# EAGLE schematic xr_vco_pots (EAGLE 7.3.0)
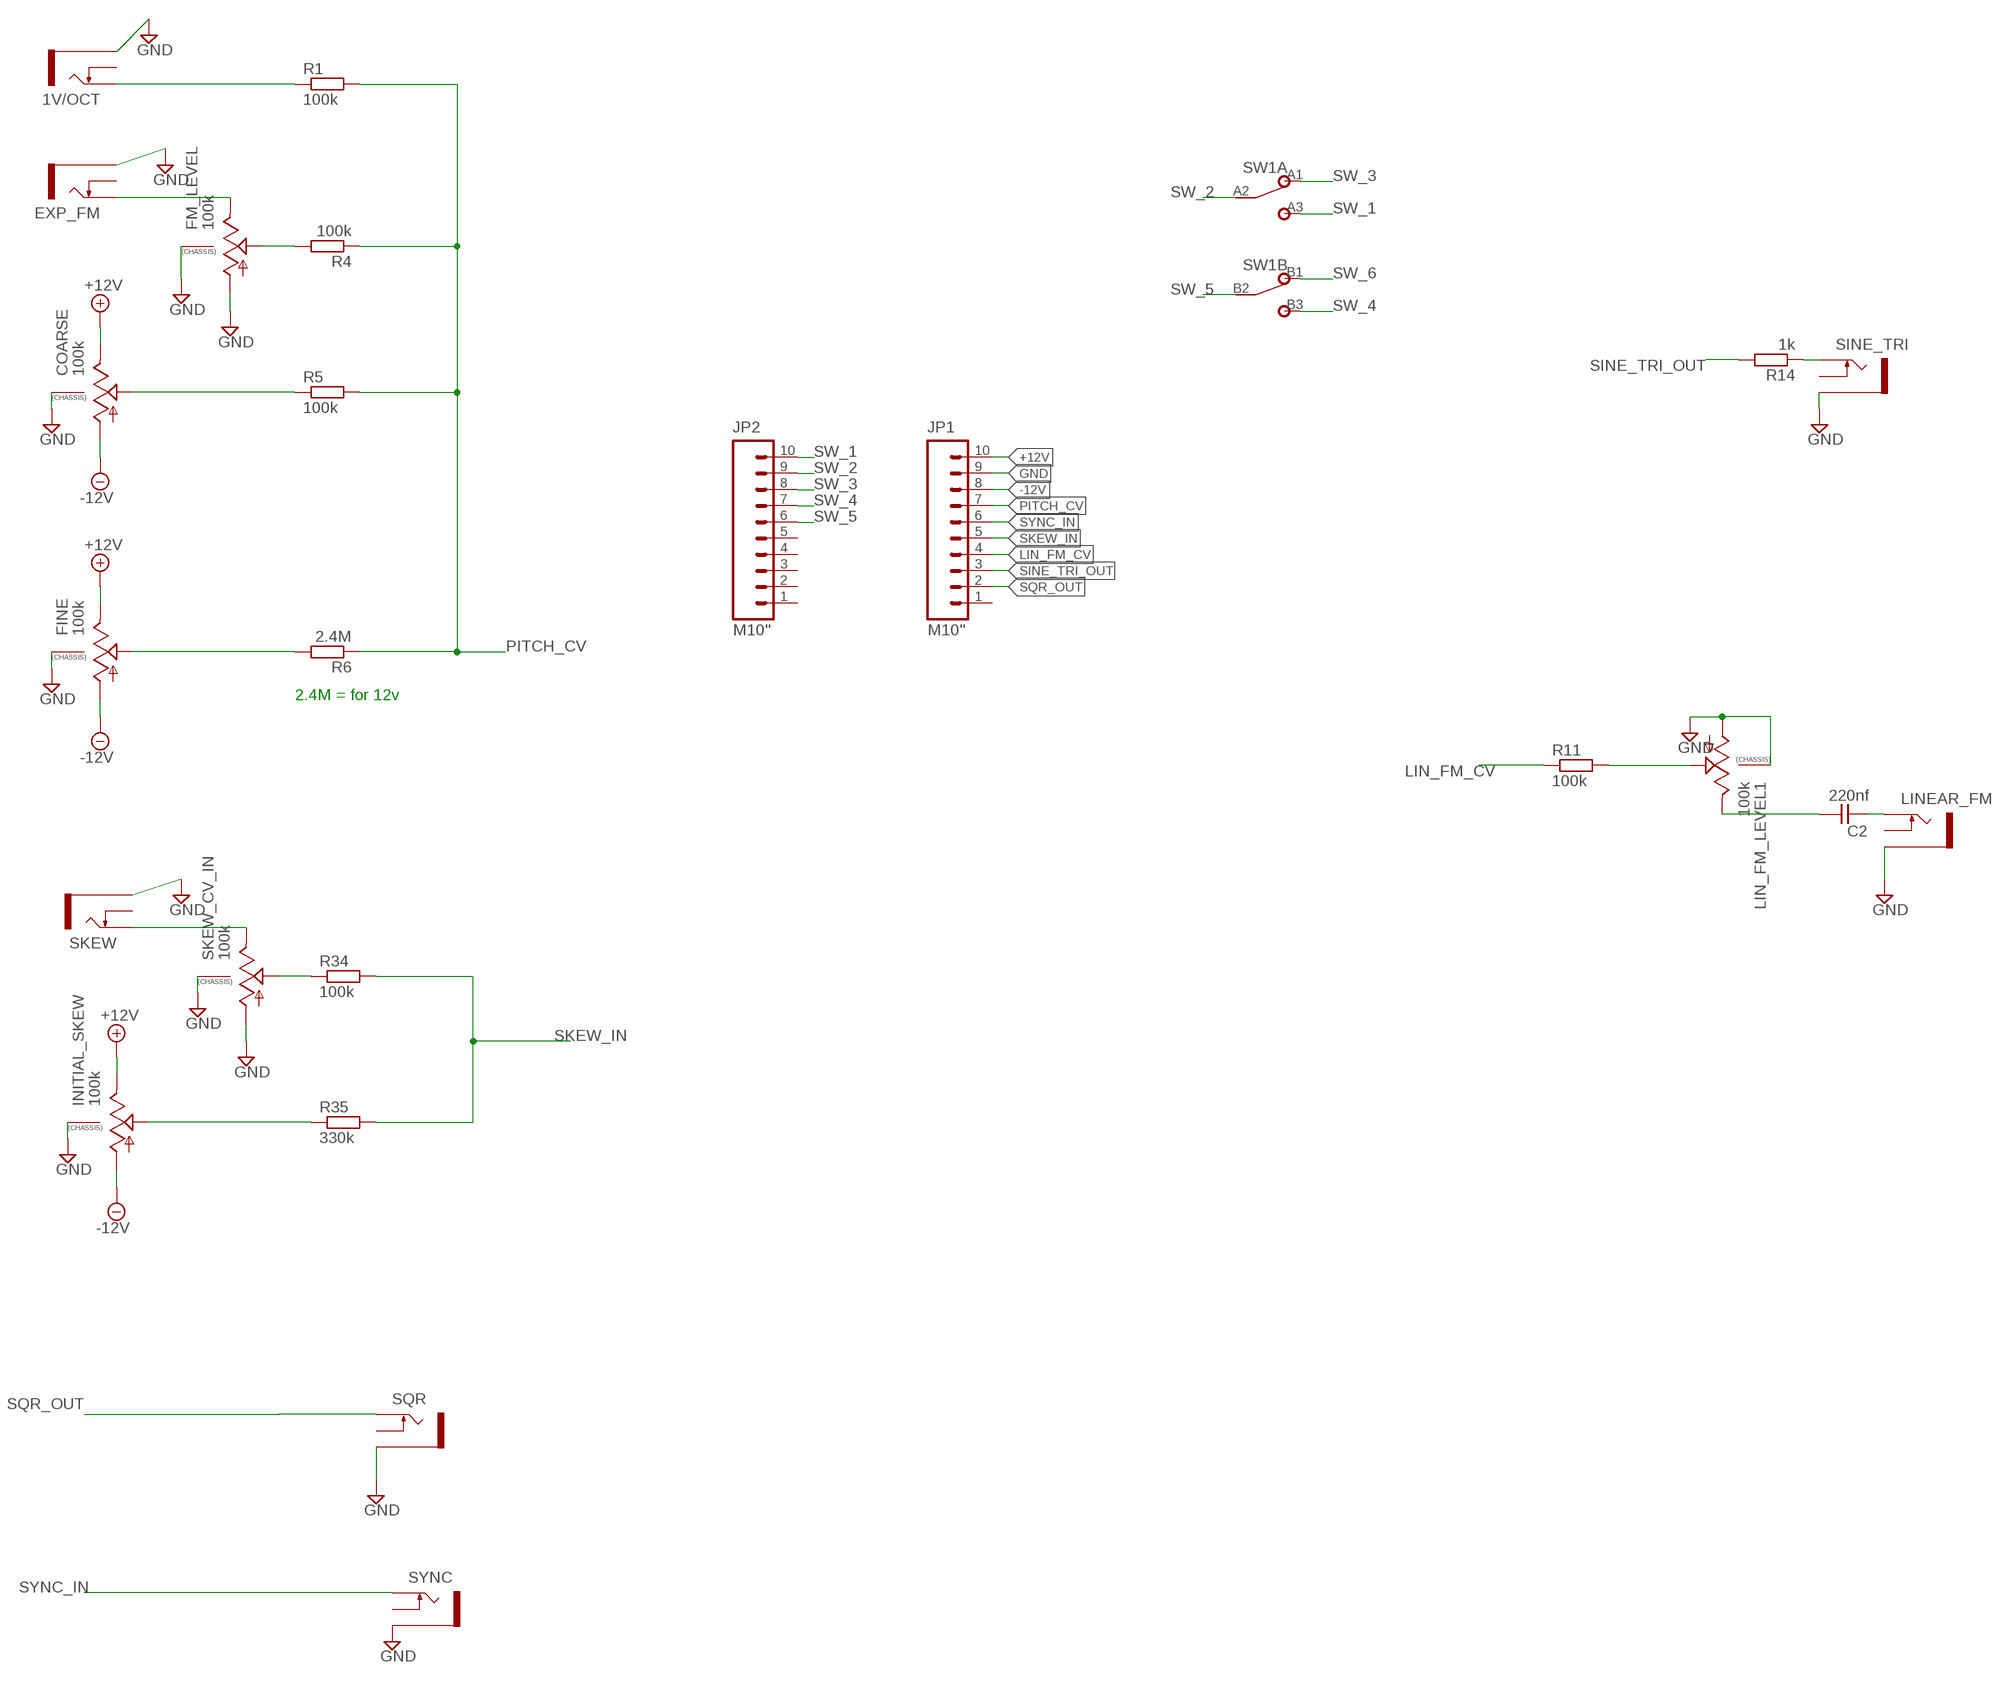
[diagram p0: schematic, sheet 1]

## Parts
1V/OCT  THONKICONNNEW  [WQP-PJ301M-12_JACK]
C2  220nf  C-EU050-024X044  [C050-024X044]
COARSE  100k  9MM_SNAP-IN_POT_CHASSIS  [9MM_SNAP-IN_POT]
EXP_FM  THONKICONNNEW  [WQP-PJ301M-12_JACK]
FINE  100k  9MM_SNAP-IN_POT_CHASSIS  [9MM_SNAP-IN_POT]
FM_LEVEL  100k  9MM_SNAP-IN_POT_CHASSIS  [9MM_SNAP-IN_POT]
INITIAL_SKEW  100k  9MM_SNAP-IN_POT_CHASSIS  [9MM_SNAP-IN_POT]
JP1  M10"  [1X10]
JP2  M10"  [1X10]
LIN_FM_LEVEL1  100k  9MM_SNAP-IN_POT_CHASSIS  [9MM_SNAP-IN_POT]
LINEAR_FM  THONKICONNNEW  [WQP-PJ301M-12_JACK]
R1  100k  RESISTOR7MM  [7MM_RESISTOR]
R4  100k  RESISTOR7MM  [7MM_RESISTOR]
R5  100k  RESISTOR7MM  [7MM_RESISTOR]
R6  2.4M  RESISTOR7MM  [7MM_RESISTOR]
R11  100k  RESISTOR7MM  [7MM_RESISTOR]
R14  1k  RESISTOR7MM  [7MM_RESISTOR]
R34  100k  RESISTOR7MM  [7MM_RESISTOR]
R35  330k  RESISTOR7MM  [7MM_RESISTOR]
SINE_TRI  THONKICONNNEW  [WQP-PJ301M-12_JACK]
SKEW  THONKICONNNEW  [WQP-PJ301M-12_JACK]
SKEW_CV_IN  100k  9MM_SNAP-IN_POT_CHASSIS  [9MM_SNAP-IN_POT]
SQR  THONKICONNNEW  [WQP-PJ301M-12_JACK]
SW1  DPDT  [DPDT]
SYNC  THONKICONNNEW  [WQP-PJ301M-12_JACK]

## Nets
+12V: COARSE.3(E) FINE.3(E) INITIAL_SKEW.3(E) JP1.10
-12V: COARSE.1(A) FINE.1(A) INITIAL_SKEW.1(A) JP1.8
GND: 1V/OCT.P$3_SLEEVE(SLEEVE) COARSE.CHASSIS2 EXP_FM.P$3_SLEEVE(SLEEVE) FINE.CHASSIS2 FM_LEVEL.1(A) FM_LEVEL.CHASSIS2 INITIAL_SKEW.CHASSIS2 JP1.9 LIN_FM_LEVEL1.1(A) LIN_FM_LEVEL1.CHASSIS2 LINEAR_FM.P$3_SLEEVE(SLEEVE) SINE_TRI.P$3_SLEEVE(SLEEVE) SKEW.P$3_SLEEVE(SLEEVE) SKEW_CV_IN.1(A) SKEW_CV_IN.CHASSIS2 SQR.P$3_SLEEVE(SLEEVE) SYNC.P$3_SLEEVE(SLEEVE)
LIN_FM_CV: JP1.4 R11.1
N$1: 1V/OCT.P$1_TIP(TIP) R1.1
N$2: EXP_FM.P$1_TIP(TIP) FM_LEVEL.3(E)
N$3: FM_LEVEL.2(S) R4.2
N$4: COARSE.2(S) R5.1
N$5: FINE.2(S) R6.2
N$17: LIN_FM_LEVEL1.2(S) R11.2
N$18: R14.1 SINE_TRI.P$1_TIP(TIP)
N$19: C2.1 LIN_FM_LEVEL1.3(E)
N$20: C2.2 LINEAR_FM.P$1_TIP(TIP)
N$42: SKEW.P$1_TIP(TIP) SKEW_CV_IN.3(E)
N$43: R34.1 SKEW_CV_IN.2(S)
N$44: INITIAL_SKEW.2(S) R35.1
PITCH_CV: JP1.7 R1.2 R4.1 R5.2 R6.1
SINE_TRI_OUT: JP1.3 R14.2
SKEW_IN: JP1.5 R34.2 R35.2
SQR_OUT: JP1.2 SQR.P$1_TIP(TIP)
SW_1: JP2.10 SW1.A3
SW_2: JP2.9 SW1.A2
SW_3: JP2.8 SW1.A1
SW_4: JP2.7 SW1.B3
SW_5: JP2.6 SW1.B2
SW_6: SW1.B1
SYNC_IN: JP1.6 SYNC.P$1_TIP(TIP)
Unconnected: 1V/OCT.P$2_SWITCH(SWITCH) EXP_FM.P$2_SWITCH(SWITCH) JP1.1 JP2.1 JP2.2 JP2.3 JP2.4 JP2.5 LINEAR_FM.P$2_SWITCH(SWITCH) SINE_TRI.P$2_SWITCH(SWITCH) SKEW.P$2_SWITCH(SWITCH) SQR.P$2_SWITCH(SWITCH) SYNC.P$2_SWITCH(SWITCH)

## Notes on the sheet
- 2.4M = for 12v

## Library data of the parts
1V/OCT EXP_FM LINEAR_FM SINE_TRI SKEW SQR SYNC = MusicThingModular:THONKICONN: 3.5mm socket for Eurorack modular synths
C2 = TomW:C-EU: CAPACITOR, European symbol
COARSE FINE FM_LEVEL INITIAL_SKEW LIN_FM_LEVEL1 SKEW_CV_IN = MusicThingModular:9MM_SNAP-IN_POT_CHASSIS: 9mm vertical snap-in pot, Alpha / Panasonic style, with a connection to the metal chassis for grounding
JP1 JP2 = SparkFun-Connectors:M10: Header 10 Standard 10-pin 0.1" header. Use with straight break away headers (SKU : PRT-00116), right angle break away headers (PRT-00553), swiss pins (PRT-00743), machine pins (PRT-00117), and female headers (PRT-00115).
R1 R4-R6 R11 R14 R34 R35 = MusicThingModular:RESISTOR: Standard resistor, various versions
SW1 = gm-switches:DPDT

## Net classes
1 power: width 0.406 mm
2 ground: width 0.305 mm